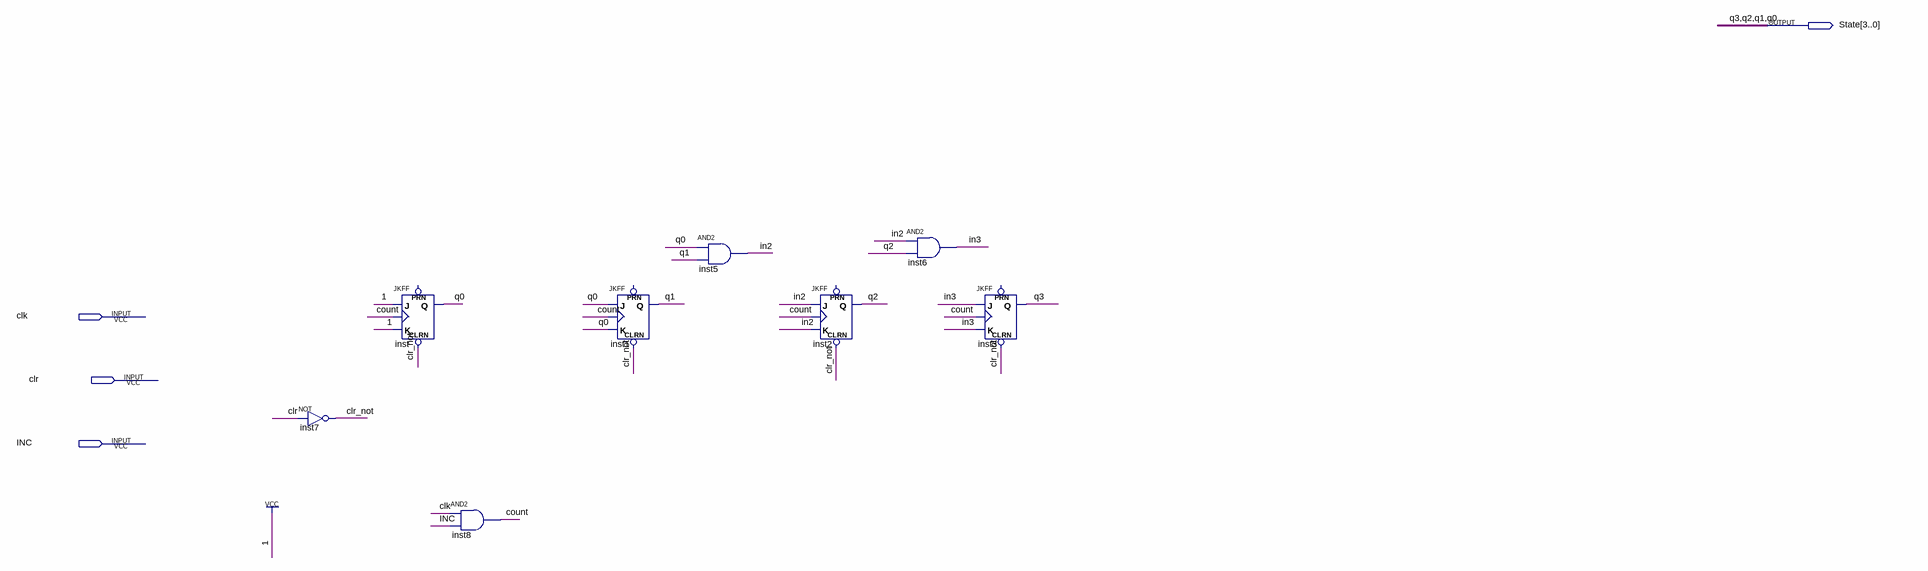
[diagram p0: schematic sheet]
// Quartus schematic Counter.bdf as structural Verilog: 8 symbols, 4 pins
module Counter (
  input  clk,
  input  clr,
  input  INC,
  output [3:0] State
);

  wire clr_not, count, in2, in3;

  not inst7 (clr_not, clr);
  JKFF inst (.CLRN(clr_not), .K(1'b1), .J(1'b1), .CLK(count), .Q(State[0]));  // open: PRN
  and inst8 (count, clk, INC);
  JKFF inst1 (.CLRN(clr_not), .K(State[0]), .J(State[0]), .CLK(count), .Q(State[1]));  // open: PRN
  and inst5 (in2, State[0], State[1]);
  JKFF inst2 (.CLRN(clr_not), .K(in2), .J(in2), .CLK(count), .Q(State[2]));  // open: PRN
  and inst6 (in3, in2, State[2]);
  JKFF inst3 (.CLRN(clr_not), .K(in3), .J(in3), .CLK(count), .Q(State[3]));  // open: PRN

  // Other names for the same wires on the sheet: q0 = State[0]; q1 = State[1]; q2 = State[2]; q3 = State[3]
endmodule
